# EAGLE schematic Analogica HB preto (EAGLE 9.5.1)
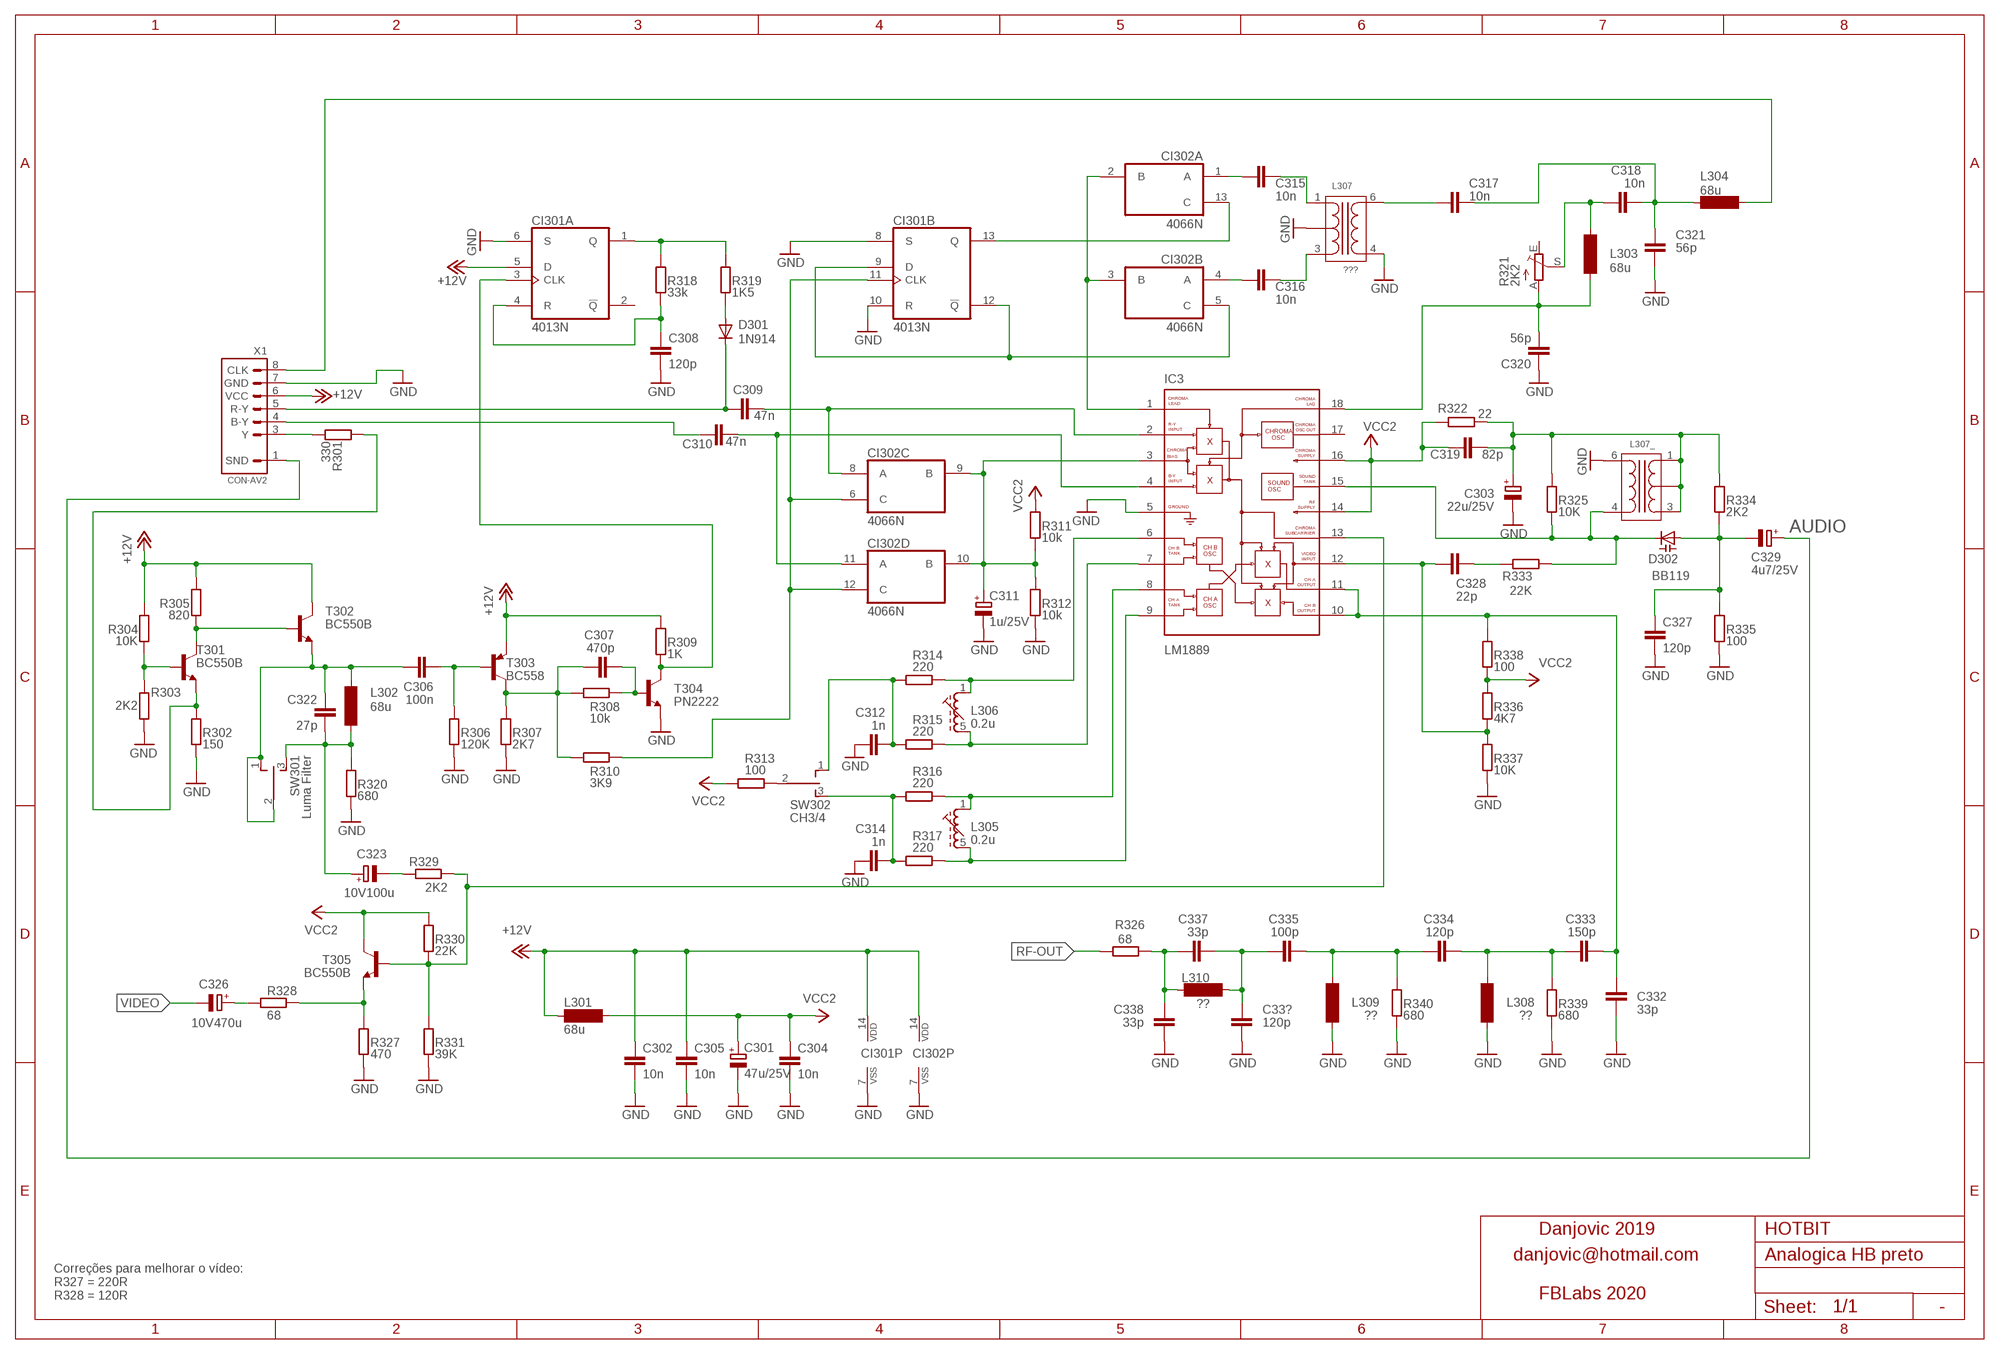
[diagram p0: schematic, sheet 1]

## Parts
C33?  120p  C-EU050-024X044  [C050-024X044]
C301  47u/25V  CPOL-EUE2.5-5  [E2,5-5]
C302  10n  C-EU050-024X044  [C050-024X044]
C303  22u/25V  CPOL-EUE2.5-5  [E2,5-5]
C304  10n  C-EU050-024X044  [C050-024X044]
C305  10n  C-EU050-024X044  [C050-024X044]
C306  100n  C-EU050-024X044  [C050-024X044]
C307  470p  C-EU050-024X044  [C050-024X044]
C308  120p  C-EU050-024X044  [C050-024X044]
C309  47n  C-EU050-024X044  [C050-024X044]
C310  47n  C-EU050-024X044  [C050-024X044]
C311  1u/25V  CPOL-EUE2.5-5  [E2,5-5]
C312  1n  C-EU050-024X044  [C050-024X044]
C314  1n  C-EU050-024X044  [C050-024X044]
C315  10n  C-EU050-024X044  [C050-024X044]
C316  10n  C-EU050-024X044  [C050-024X044]
C317  10n  C-EU050-024X044  [C050-024X044]
C318  10n  C-EU050-024X044  [C050-024X044]
C319  82p  C-EU050-024X044  [C050-024X044]
C320  56p  C-EU050-024X044  [C050-024X044]
C321  56p  C-EU050-024X044  [C050-024X044]
C322  27p  C-EU050-024X044  [C050-024X044]
C323  10V100u  CPOL-EUE2.5-5  [E2,5-5]
C326  10V470u  CPOL-EUE2.5-5  [E2,5-5]
C327  120p  C-EU050-024X044  [C050-024X044]
C328  22p  C-EU050-024X044  [C050-024X044]
C329  4u7/25V  CPOL-EUE2.5-5  [E2,5-5]
C332  33p  C-EU050-024X044  [C050-024X044]
C333  150p  C-EU050-024X044  [C050-024X044]
C334  120p  C-EU050-024X044  [C050-024X044]
C335  100p  C-EU050-024X044  [C050-024X044]
C337  33p  C-EU050-024X044  [C050-024X044]
C338  33p  C-EU050-024X044  [C050-024X044]
CI301  4013N  [DIL14]
CI302  4066N  [DIL14]
D301  1N914  1N4148DO35-7  [DO35-7]
D302  BB119  BB112  [SOT54H]
IC3  LM1889  [DIL18]
L301  68u  SD75  [SD75]
L302  68u  SD75  [SD75]
L303  68u  SD75  [SD75]
L304  68u  SD75  [SD75]
L305  0.2u  51K  [71K]
L306  0.2u  51K  [71K]
L307  ???  TRAVO-RF-4W""  [TRAFO-RF-6W]
L307_  TRAVO-RF-4W""  [TRAFO-RF-6W]
L308  ??  SD75  [SD75]
L309  ??  SD75  [SD75]
L310  ??  SD75  [SD75]
R301  330  R-EU_0204/7  [0204/7]
R302  150  R-EU_0204/7  [0204/7]
R303  2K2  R-EU_0204/7  [0204/7]
R304  10K  R-EU_0204/7  [0204/7]
R305  820  R-EU_0204/7  [0204/7]
R306  120K  R-EU_0204/7  [0204/7]
R307  2K7  R-EU_0204/7  [0204/7]
R308  10k  R-EU_0204/7  [0204/7]
R309  1K  R-EU_0204/7  [0204/7]
R310  3K9  R-EU_0204/7  [0204/7]
R311  10k  R-EU_0204/7  [0204/7]
R312  10k  R-EU_0204/7  [0204/7]
R313  100  R-EU_0204/7  [0204/7]
R314  220  R-EU_0204/7  [0204/7]
R315  220  R-EU_0204/7  [0204/7]
R316  220  R-EU_0204/7  [0204/7]
R317  220  R-EU_0204/7  [0204/7]
R318  33k  R-EU_0204/7  [0204/7]
R319  1K5  R-EU_0204/7  [0204/7]
R320  680  R-EU_0204/7  [0204/7]
R321  2K2  TRIM_EU-S64Y  [S64Y]
R322  22  R-EU_0204/7  [0204/7]
R325  10K  R-EU_0204/7  [0204/7]
R326  68  R-EU_0204/7  [0204/7]
R327  470  R-EU_0204/7  [0204/7]
R328  68  R-EU_0204/7  [0204/7]
R329  2K2  R-EU_0204/7  [0204/7]
R330  22K  R-EU_0204/7  [0204/7]
R331  39K  R-EU_0204/7  [0204/7]
R333  22K  R-EU_0204/7  [0204/7]
R334  2K2  R-EU_0204/7  [0204/7]
R335  100  R-EU_0204/7  [0204/7]
R336  4K7  R-EU_0204/7  [0204/7]
R337  10K  R-EU_0204/7  [0204/7]
R338  100  R-EU_0204/7  [0204/7]
R339  680  R-EU_0204/7  [0204/7]
R340  680  R-EU_0204/7  [0204/7]
SW301  Luma Filter  TL39PO  [TL3XPO]
SW302  CH3/4  TL39PO  [TL3XPO]
T301  BC550B  BC317-NPN-TO92-EBC  [TO92-EBC]
T302  BC550B  BC317-NPN-TO92-EBC  [TO92-EBC]
T303  BC558  BC327  [TO92-EBC]
T304  PN2222  MPS2222A-NPN-TO92-CBE  [TO92-CBE]
T305  BC550B  [TO92-EBC]
X1  CON-AV2  [CON-AV2]

## Nets
+12V: C302.1 C305.1 CI301.5(A:D) CI301.14(P:VDD) CI302.14(P:VDD) L301.1 R304.2 R305.2 R309.2 T302.C T303.E X1.6(VCC)
AUDIO: C329.+ X1.1(SND)
GND: C33?.2 C301.- C302.2 C303.- C304.2 C305.2 C308.2 C311.- C312.2 C314.2 C320.1 C321.2 C327.2 C332.2 C338.2 CI301.6(A:S) CI301.7(P:VSS) CI301.8(B:S) CI301.10(B:R) CI302.7(P:VSS) IC3.5 L307.2 L307.4 L307_.6 L308.1 L309.1 R302.1 R303.1 R306.1 R307.1 R312.1 R320.1 R327.1 R331.1 R335.1 R337.1 R339.1 R340.1 T304.E X1.7(GND)
N$1: C308.1 CI301.4(A:R) R318.1
N$2: CI301.1(A:Q) R318.2 R319.2
N$3: D301.A R319.1
N$4: C309.1 D301.C X1.5(R-Y)
N$5: C310.1 X1.4(B-Y)
N$6: C309.2 CI302.8(C:A) IC3.2
N$7: C310.2 CI302.11(D:A) IC3.4
N$8: C316.1 CI302.4(B:A)
N$9: CI301.13(B:Q) CI302.13(A:C)
N$10: CI301.9(B:D) CI301.12(B:!Q) CI302.5(B:C)
N$11: CI302.2(A:B) CI302.3(B:B) IC3.1
N$12: C315.1 CI302.1(A:A)
N$13: C315.2 L307.1
N$14: C316.2 L307.3
N$15: C317.1 L307.6
N$16: R305.1 T301.C T302.B
N$17: C326.+ R328.1
N$18: C303.+ C319.2 L307_.1 L307_.2 L307_.3 R322.1 R325.2 R334.2
N$19: C311.+ CI302.9(C:B) CI302.10(D:B) IC3.3 R311.1 R312.2
N$20: C318.1 L303.2 R321.S
N$21: C317.2 C318.2 C321.1 L304.1
N$22: L304.2 X1.8(CLK)
N$23: D302.C IC3.15 L307_.4 R325.1 R333.1
N$24: C328.2 R333.2
N$25: C327.1 C329.- D302.A R334.1 R335.2
N$26: C332.1 C333.1 IC3.10 IC3.11 R338.2
N$27: C337.2 C338.1 L310.2 R326.1
N$28: C328.1 IC3.12 R336.1 R337.2
N$29: C33?.1 C335.2 C337.1 L310.1
N$30: C334.2 C335.1 L309.2 R340.2
N$31: C333.2 C334.1 L308.2 R339.2
N$32: IC3.6 L306.1(A) R314.2
N$33: IC3.7 L306.5(E) R315.2
N$34: C312.1 R314.1 R315.1 SW302.1(O)
N$35: IC3.8 L305.1(A) R316.2
N$36: IC3.9 L305.5(E) R317.2
N$37: C314.1 R316.1 R317.1 SW302.3(S)
N$38: R313.2 SW302.2(P)
N$39: C323.- R329.2
N$40: C306.1 R306.2 T303.B
N$41: R301.1 X1.3(Y)
N$42: CI301.11(B:CLK) CI302.6(C:C) CI302.12(D:C) R310.2
N$43: C322.2 C323.+ L302.1 R320.2 SW301.3(S)
N$44: R303.2 R304.1 T301.B
N$45: C307.1 R308.2 T304.B
N$46: CI301.3(A:CLK) R309.1 T304.C
N$47: R327.2 R328.2 T305.E
N$48: C320.2 IC3.18 L303.1 R321.A
N$50: R301.2 R302.2 T301.E
N$51: C307.2 R307.2 R308.1 R310.1 T303.C
N$52: C306.2 C322.1 L302.2 SW301.1(O) SW301.2(P) T302.E
N$53: IC3.13 R329.1 R330.1 R331.2 T305.B
RF-OUT: R326.2
VCC2: C301.+ C304.1 C319.1 IC3.14 IC3.16 L301.2 R311.2 R313.1 R322.2 R330.2 R336.2 R338.1 T305.C
VIDEO: C326.-
Unconnected: CI301.2(A:!Q) IC3.17 L305.S1(S2) L305.S2(S1) L306.S1(S2) L306.S2(S1) L307.SH1 L307.SH2 L307_.SH1 L307_.SH2 R321.E

## Notes on the sheet
- Danjovic 2019 | HOTBIT
- danjovic@hotmail.com
- Correções para melhorar o vídeo:
  R327 = 220R
  R328 = 120R
- FBLabs 2020
- -

## Library data of the parts
C33? C302 C304-C310 C312 C314-C322 C327 C328 C332-C335 C337 C338 = rcl:C-EU: CAPACITOR, European symbol
C301 C303 C311 C323 C326 C329 = rcl:CPOL-EU: POLARIZED CAPACITOR, European symbol
CI301 = 40xx:4013: Dual D FLIP FLOP, set/reset
CI302 = 40xx:4066: Quad bilateral ANALOG SWITCH
D301 = diode:1N4148: DIODE high speed (Philips)
D302 = diode:BB112: Capacity DIODE variable-capacitance diode
IC3 = hotbit:LM1889: LM1889 TV Video Modulator The LM1889 is designed to interface audio, color difference, and luminance signals to the antenna terminals of a TV receiver. It consists of a sound subcarrier oscillator, chroma subcarrier oscillator, quadrature chroma modulators, and RF oscillators and modulators for two low-VHF channels. The LM1889 allows video information from VTR’s, games, test equipment, or similar sources to be displayed on black and white or color TV receivers. When used with the MM57100 and MM53104, a complete TV game is formed
L301-L304 L308-L310 = inductor-neosid:SD75: INDUCTOR nominal inductance, E12; OC_FARNELL: unknown; OC_NEWARK: unknown
L305 L306 = inductor-neosid:51K: FILTER pre-adjusted RF filter, type K, standard value E-12; OC_FARNELL: unknown; OC_NEWARK: unknown
L307 L307_ = hotbit:TRAVO-RF-4W
R301-R320 R322 R325-R331 R333-R340 = rcl:R-EU_: RESISTOR, European symbol
R321 = pot:TRIM_EU-: POTENTIOMETER
SW301 SW302 = switch:TL39PO: TINY SWITCH ON OFF ON Source: http://www2.produktinfo.conrad.com/datenblaetter/700000-724999/705152-da-01-de-Subminiaturschalter_TL_36YO.pdf
T301 T302 T304 = transistor:*-NPN-: NPN Transistror BF959 corrected 2008.03.06
T303 = transistor-pnp:BC327*: PNP Transistror
T305 = transistor-npn:BC550*: NPN Transistor
X1 = hotbit:CON-AV2: .100" (2.54mm) Center Header - 7 Pin